# Altium schematic sheet FLEX_INPUTS.SchDoc
size A4
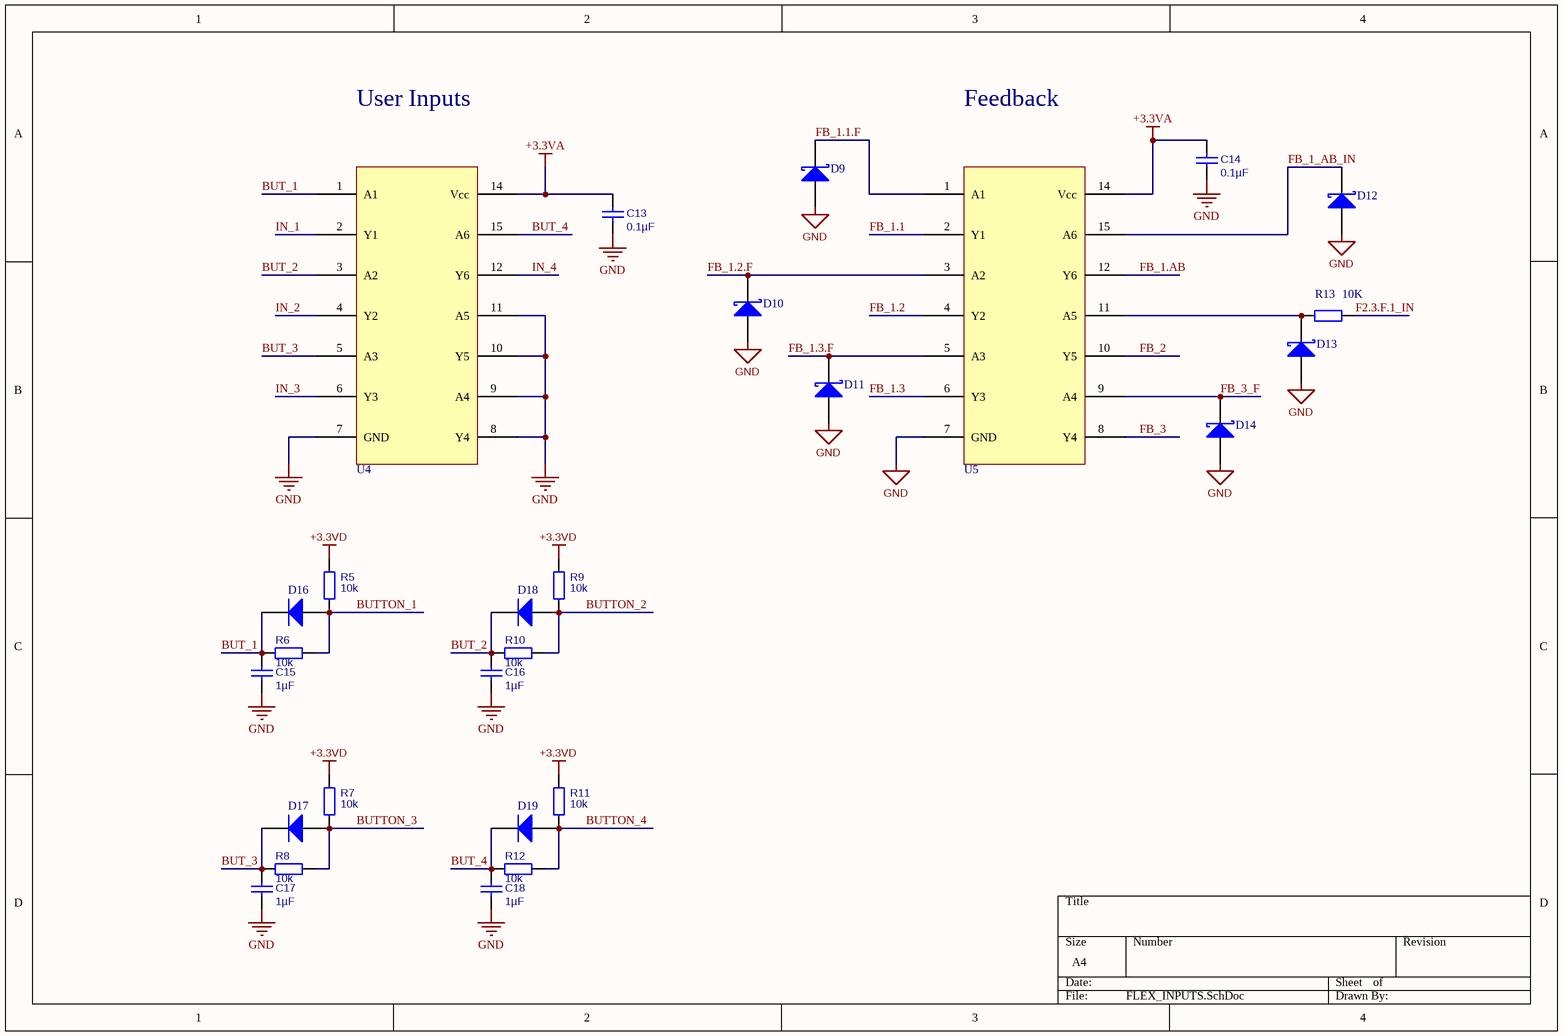
[diagram p0: FLEX_INPUTS.SchDoc]

## Parts
C13  value 0.1µF  [TDK C-Series (1608)]  (hidden comment: Cap)
C14  value 0.1µF  [TDK C-Series (1608)]  (hidden comment: Cap)
C15  value 1µF  [TDK C-Series (1608)]  (hidden comment: Cap)
C16  value 1µF  [TDK C-Series (1608)]  (hidden comment: Cap)
C17  value 1µF  [TDK C-Series (1608)]  (hidden comment: Cap)
C18  value 1µF  [TDK C-Series (1608)]  (hidden comment: Cap)
D9  Diode BAT17  [Diode_TVS SODFL100X45-2N]  (value not drawn)
D10  Diode BAT17  [Diode_TVS SODFL100X45-2N]  (value not drawn)
D11  Diode BAT17  [Diode_TVS SODFL100X45-2N]  (value not drawn)
D12  Diode BAT17  [Diode_TVS SODFL100X45-2N]  (value not drawn)
D13  Diode BAT17  [Diode_TVS SODFL100X45-2N]  (value not drawn)
D14  Diode BAT17  [Diode_TVS SODFL100X45-2N]  (value not drawn)
D16  de  [Diode_Shottky]  (value not drawn)
D17  de  [Diode_Shottky]  (value not drawn)
D18  de  [Diode_Shottky]  (value not drawn)
D19  de  [Diode_Shottky]  (value not drawn)
R5  value 10k  [Panasonic ERJ-Series (1608)]
R6  value 10k  [Panasonic ERJ-Series (1608)]
R7  value 10k  [Panasonic ERJ-Series (1608)]
R8  value 10k  [Panasonic ERJ-Series (1608)]
R9  value 10k  [Panasonic ERJ-Series (1608)]
R10  value 10k  [Panasonic ERJ-Series (1608)]
R11  value 10k  [Panasonic ERJ-Series (1608)]
R12  value 10k  [Panasonic ERJ-Series (1608)]
R13  value 10K  [Panasonic ERJ-Series (1608)]
U4  MC74VHCT50A  (value not drawn)
U5  MC74VHCT50A  (value not drawn)

## Nets
+3.3VA: C13.2 C14.2 U4.14(Vcc) U5.14(Vcc)
+3.3VD: R5.1 R7.1 R9.1 R11.1
GND: C13.1 C14.1 C15.1 C16.1 C17.1 C18.1 D9.1(A) D10.1(A) D11.1(A) D12.1(A) D13.1(A) D14.1(A) U4.7(GND) U4.8(Y4) U4.9(A4) U4.10(Y5) U4.11(A5) U5.7(GND)
BUT_1: C15.2 D16.2(K) R6.1 U4.1(A1)
BUT_2: C16.2 D18.2(K) R10.1 U4.3(A2)
BUT_3: C17.2 D17.2(K) R8.1 U4.5(A3)
BUT_4: C18.2 D19.2(K) R12.1 U4.15(A6)
BUTTON_1: D16.1(A) R5.2 R6.2
BUTTON_2: D18.1(A) R9.2 R10.2
BUTTON_3: D17.1(A) R7.2 R8.2
BUTTON_4: D19.1(A) R11.2 R12.2
F2.3.F.1_IN: R13.1
FB_1.1: U5.2(Y1)
FB_1.1.F: D9.3(K) U5.1(A1)
FB_1.2: U5.4(Y2)
FB_1.2.F: D10.3(K) U5.3(A2)
FB_1.3: U5.6(Y3)
FB_1.3.F: D11.3(K) U5.5(A3)
FB_1.AB: U5.12(Y6)
FB_1_AB_IN: D12.3(K) U5.15(A6)
FB_2: U5.10(Y5)
FB_3: U5.8(Y4)
FB_3_F: D14.3(K) U5.9(A4)
IN_1: U4.2(Y1)
IN_2: U4.4(Y2)
IN_3: U4.6(Y3)
IN_4: U4.12(Y6)
NetD13_3: D13.3(K) R13.2 U5.11(A5)

## Notes on the sheet
- User Inputs
- Feedback

## Library data of the parts
C13-C18 = Cap: Capacitor; Published: 8-Jun-2000; LatestRevisionDate: 17-Jul-2002; LatestRevisionNote: Re-released for DXP Platform.; PackageReference: RAD-0.3; Publisher: Altium Limited; PackageDescription: Radial Cap, Thru-Hole; 2 Leads; 0.3 in Pin Spacing; Supplier 1: Digi-Key
  C13: Supplier Part Number 1: 445-1316-1-ND
  C14-C18: Supplier Part Number 1: 445-5146-1-ND
D9-D14 = Diode BAT17: Silicon RF Schottky Diode for Mixer Applications in the VHF/UHF Range; Note: Pin 2 is not connected and not drawn.; Published: 21-Mar-2003; LatestRevisionDate: 29-May-2009; LatestRevisionNote: IPC-7351 Footprint Added.; DatasheetVersion: Oct-1999; PackageVersion: Sep-2001; PackageReference: SOT-23; Publisher: Altium Limited; PackageDescription: 3-Pin SOT-23 Package 0.95 mm Pitch, 2.5 mm Lead Span; ComponentLink1Description: Manufacturer Link; ComponentLink1URL: http://www.infineon.com/; ComponentLink2Description: Datasheet; ComponentLink2URL: http://www.infineon.com/upload/Document/cmc_upload/documents/009/363/bat17series.pdf; Supplier 1: Digi-Key; Supplier Part Number 1: DF2S5.6FSL3MCT-ND
D16-D19 = Diode: Default Diode; Published: 8-Jun-2000; LatestRevisionDate: 17-Jul-2002; LatestRevisionNote: Re-released for DXP Platform.; PackageVersion: Sep-1996; PackageReference: SMC; Publisher: Altium Limited; PackageDescription: DO-214-AB/SMC; 2 C-Bend Leads; Body 7.9 x 5.9 mm, inc. leads (LxW); Code_JEDEC: DO-214-AB; Supplier 1: Digi-Key; Supplier Part Number 1: 1727-5384-1-ND
R5-R13 = Res2: Resistor; Published: 8-Jun-2000; LatestRevisionDate: 17-Jul-2002; LatestRevisionNote: Re-released for DXP Platform.; PackageReference: AXIAL-0.4; Publisher: Altium Limited; PackageDescription: Axial Device, Thru-Hole; 2 Leads; 0.4 in Pin Spacing; Supplier 1: Digi-Key
  R5-R12: Supplier Part Number 1: P10.0KHCT-ND
  R13: Supplier 2: Digi-Key; Supplier Part Number 2: P10.0KHCT-ND
U4 U5 = MC74VHCT50A: 6-Channel CMOS Buffer